# Altium schematic sheet Interfaces.SchDoc
size A4; SheetNumber: 4; SheetTotal: 4
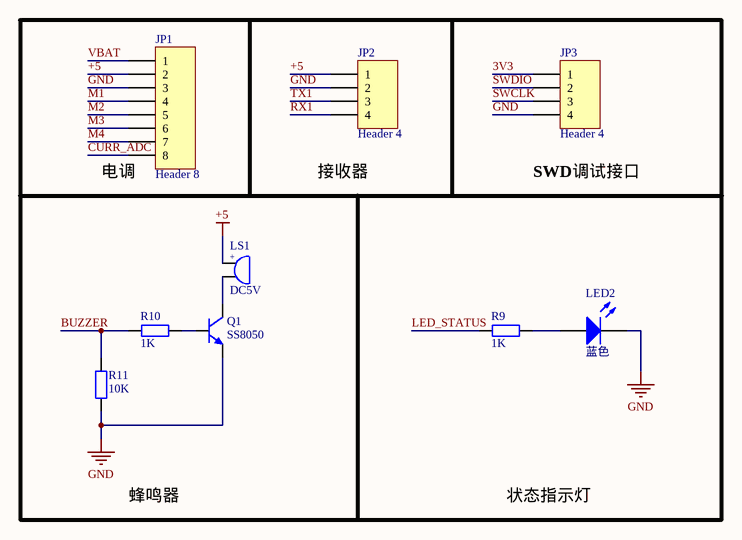
[diagram p0: Interfaces.SchDoc]

## Parts
JP1  Header 8  [SH1.0-WT-8P]
JP2  Header 4  [PAD-1X4-SMD]
JP3  Header 4  [PAD-1X4-SMD]
LED2  蓝色  [LED0603_B]
LS1  DC5V  [BUZZER]
Q1  SS8050  [SOT23-3L]
R9  1K  [R0402_M]
R10  1K  [R0402_M]
R11  10K  [R0402_M]

## Nets
+5: JP1.2 JP2.1 LS1.1
GND: JP1.3 JP2.2 JP3.4 LED2.2(K) Q1.2(E) R11.1
3V3: JP3.1
BUZZER: R10.1 R11.2
CURR_ADC: JP1.8
LED_STATUS: R9.1
M1: JP1.4
M2: JP1.5
M3: JP1.6
M4: JP1.7
RX1: JP2.4
SWCLK: JP3.3
SWDIO: JP3.2
TX1: JP2.3
VBAT: JP1.1
NetLED2_1: LED2.1(A) R9.2
NetLS1_2: LS1.2 Q1.3(C)
NetQ1_1: Q1.1(B) R10.2

## Notes on the sheet
- (near JP1) 电调
- (near JP2) 接收器
- (near JP3) SWD调试接口
- 蜂鸣器
- 状态指示灯
- (in symbol BEEP) +

## Library data of the parts
JP1 = Header 8: Header, 8-Pin; Revision: 17-Jul-2002: Re-released for DXP Platform.; Publisher: Altium Limited
JP2 JP3 = Header 4: Header, 4-Pin; Revision: 17-Jul-2002: Re-released for DXP Platform.; Publisher: Altium Limited
LED2 = LED: 贴片LED; 封装库来自淘宝卖家：黄晶宝石: 其他店铺购入均为盗版封装库，无更新权益，请立即申请退款，本店现金奖励200~1000元; BOM名称: 贴片LED
LS1 = BEEP: 蜂鸣器; 联系下单店铺卖家 免费技术支持: 联系下单店铺卖家 免费帮你查找封装; BOM名称: 蜂鸣器
Q1 = 8050-SMD: 高频放大-NPN型; 参数: 40V 1.5A 1W 100MHZ; 联系下单店铺卖家 免费帮你查找封装: 联系下单店铺卖家 免费技术支持; BOM名称: 高频放大-NPN型
R9-R11 = R: 贴片电阻; 联系下单店铺卖家 免费帮你查找封装: 联系下单店铺卖家 免费技术支持; BOM名称: 贴片电阻